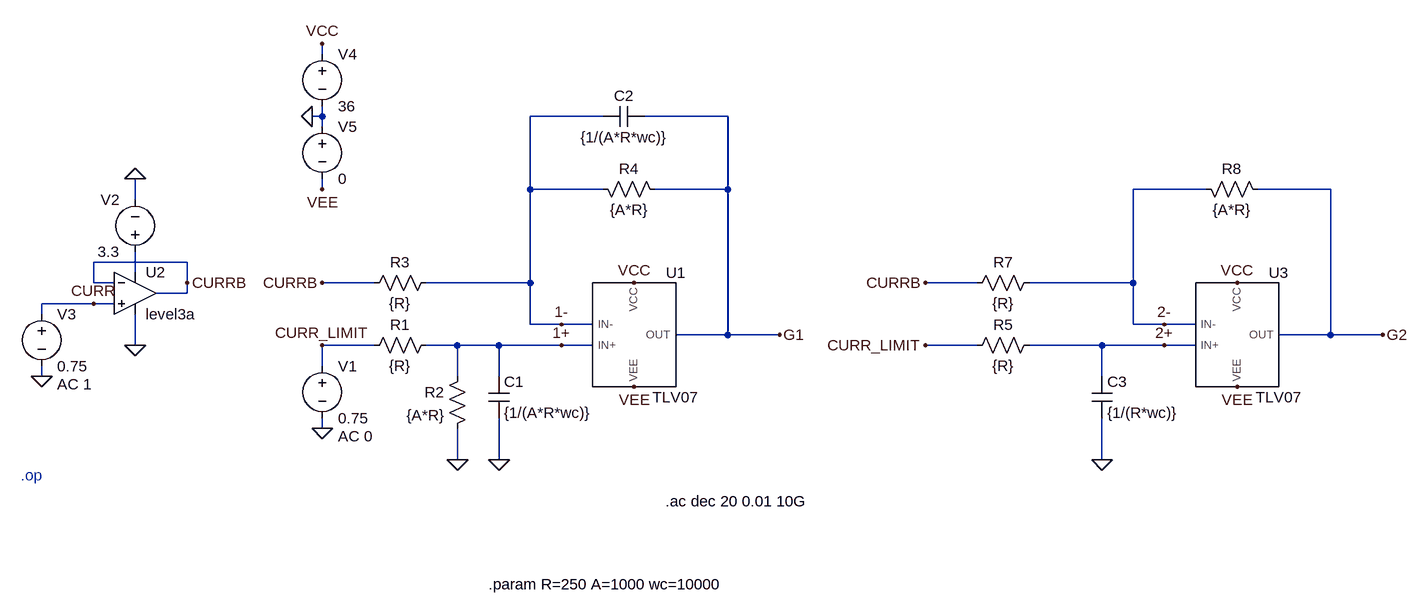
[diagram p0: schematic Draft2.asc]
Draft2.asc, the LTspice schematic file:
Version 4.1
SHEET 1 1280 680
WIRE -400 -192 -400 -208
WIRE -400 -96 -400 -112
WIRE -400 -96 -416 -96
WIRE 32 -96 -80 -96
WIRE 224 -96 96 -96
WIRE -400 -80 -400 -96
WIRE -400 16 -400 0
WIRE -80 16 -80 -96
WIRE 32 16 -80 16
WIRE 224 16 224 -96
WIRE 224 16 112 16
WIRE 960 16 848 16
WIRE 1152 16 1040 16
WIRE -688 32 -688 0
WIRE -608 128 -752 128
WIRE -688 144 -688 112
WIRE -752 160 -752 128
WIRE -720 160 -752 160
WIRE -608 160 -608 128
WIRE -320 160 -400 160
WIRE -80 160 -80 16
WIRE -80 160 -240 160
WIRE 608 160 528 160
WIRE 848 160 848 16
WIRE 848 160 688 160
WIRE -608 176 -608 160
WIRE -608 176 -656 176
WIRE -752 192 -832 192
WIRE -720 192 -752 192
WIRE -832 208 -832 192
WIRE -80 224 -80 160
WIRE -32 224 -80 224
WIRE 16 224 -32 224
WIRE 848 224 848 160
WIRE 896 224 848 224
WIRE 944 224 896 224
WIRE 224 240 224 16
WIRE 224 240 144 240
WIRE 304 240 224 240
WIRE 1152 240 1152 16
WIRE 1152 240 1072 240
WIRE 1232 240 1152 240
WIRE -688 256 -688 208
WIRE -320 256 -400 256
WIRE -192 256 -240 256
WIRE -128 256 -192 256
WIRE -32 256 -128 256
WIRE 16 256 -32 256
WIRE 608 256 528 256
WIRE 800 256 688 256
WIRE 896 256 800 256
WIRE 944 256 896 256
WIRE -400 288 -400 256
WIRE -832 304 -832 288
WIRE -192 304 -192 256
WIRE -128 304 -128 256
WIRE 800 304 800 256
WIRE -400 384 -400 368
WIRE -192 432 -192 384
WIRE -128 432 -128 368
WIRE 800 432 800 368
FLAG -400 384 0
FLAG -192 432 0
FLAG -128 432 0
FLAG 80 160 VCC
FLAG 80 320 VEE
FLAG 304 240 G1
FLAG -400 160 CURRB
FLAG -400 256 CURR_LIMIT
FLAG -32 256 1+
FLAG -32 224 1-
FLAG -688 0 0
FLAG -688 256 0
FLAG -752 192 CURR
FLAG -608 160 CURRB
FLAG -832 304 0
FLAG 800 432 0
FLAG 1008 160 VCC
FLAG 1008 320 VEE
FLAG 1232 240 G2
FLAG 528 160 CURRB
FLAG 528 256 CURR_LIMIT
FLAG 896 256 2+
FLAG 896 224 2-
FLAG -400 16 VEE
FLAG -400 -208 VCC
FLAG -416 -96 0
SYMBOL TLV07 80 240 R0
SYMATTR InstName U1
SYMBOL voltage -400 272 R0
WINDOW 123 24 124 Left 2
WINDOW 39 0 0 Left 0
SYMATTR InstName V1
SYMATTR Value 0.75
SYMATTR Value2 AC 0
SYMBOL res -224 240 R90
WINDOW 0 0 56 VBottom 2
WINDOW 3 32 56 VTop 2
SYMATTR InstName R1
SYMATTR Value {R}
SYMBOL res -176 288 M0
SYMATTR InstName R2
SYMATTR Value {A*R}
SYMBOL cap -144 304 R0
SYMATTR InstName C1
SYMATTR Value {1/(A*R*wc)}
SYMBOL res -224 144 R90
WINDOW 0 0 56 VBottom 2
WINDOW 3 32 56 VTop 2
SYMATTR InstName R3
SYMATTR Value {R}
SYMBOL res 128 32 M270
WINDOW 0 32 56 VTop 2
WINDOW 3 0 56 VBottom 2
SYMATTR InstName R4
SYMATTR Value {A*R}
SYMBOL cap 96 -112 R90
WINDOW 0 0 32 VBottom 2
WINDOW 3 32 32 VTop 2
SYMATTR InstName C2
SYMATTR Value {1/(A*R*wc)}
SYMBOL OpAmps\\UniversalOpAmp3 -688 176 R0
SYMATTR InstName U2
SYMBOL voltage -688 128 R180
WINDOW 0 24 96 Left 2
WINDOW 3 24 16 Left 2
WINDOW 123 0 0 Left 0
WINDOW 39 0 0 Left 0
SYMATTR InstName V2
SYMATTR Value 3.3
SYMBOL voltage -832 192 R0
WINDOW 123 24 124 Left 2
WINDOW 39 0 0 Left 0
SYMATTR InstName V3
SYMATTR Value 0.75
SYMATTR Value2 AC 1
SYMBOL TLV07 1008 240 R0
SYMATTR InstName U3
SYMBOL res 704 240 R90
WINDOW 0 0 56 VBottom 2
WINDOW 3 32 56 VTop 2
SYMATTR InstName R5
SYMATTR Value {R}
SYMBOL cap 784 304 R0
SYMATTR InstName C3
SYMATTR Value {1/(R*wc)}
SYMBOL res 704 144 R90
WINDOW 0 0 56 VBottom 2
WINDOW 3 32 56 VTop 2
SYMATTR InstName R7
SYMATTR Value {R}
SYMBOL res 1056 32 M270
WINDOW 0 32 56 VTop 2
WINDOW 3 0 56 VBottom 2
SYMATTR InstName R8
SYMATTR Value {A*R}
SYMBOL voltage -400 -208 R0
WINDOW 123 0 0 Left 0
WINDOW 39 0 0 Left 0
SYMATTR InstName V4
SYMATTR Value 36
SYMBOL voltage -400 -96 R0
WINDOW 123 0 0 Left 0
WINDOW 39 0 0 Left 0
SYMATTR InstName V5
SYMATTR Value 0
TEXT -864 456 Left 2 ;.op
TEXT -144 624 Left 2 !.param R=250 A=1000 wc=10000
TEXT 128 496 Left 2 !.ac dec 20 0.01 10G

The netlist it stands for:
* Draft2.asc
X§U1 1+ 1- VCC VEE G1 TLV07  ; pins IN+ IN- VCC VEE OUT
V1 CURR_LIMIT 0 0.75 AC 0
R1 1+ CURR_LIMIT {R}
R2 1+ 0 {A*R}
C1 1+ 0 {1/(A*R*wc)}
R3 1- CURRB {R}
R4 G1 1- {A*R}
C2 G1 1- {1/(A*R*wc)}
X§U2 CURR CURRB N001 0 CURRB level3a  ; pins In+ In- V+ V- OUT
V2 N001 0 3.3
V3 CURR 0 0.75 AC 1
X§U3 2+ 2- VCC VEE G2 TLV07  ; pins IN+ IN- VCC VEE OUT
R5 2+ CURR_LIMIT {R}
C3 2+ 0 {1/(R*wc)}
R7 2- CURRB {R}
R8 G2 2- {A*R}
V4 VCC 0 36
V5 0 VEE 0
* .op
.param R=250 A=1000 wc=10000
.ac dec 20 0.01 10G
.lib C:\Users\Tachi\Documents\Nerd Shit\rm_electrical-supercap\SPICE_sims\libraries\TLV07.LIB
.backanno
.end